# Altium schematic sheet FPGA_Memec_Virtex2P4_Dev_Board.SchDoc: Example for Virtex-II Pro Dev. Board
size B; Address1: L3, 12a Rodborough Rd; Address2: Frenchs Forest; Address3: NSW; Address4: Australia 2086; DocumentNumber: 1; Organization: Altium Limited; SheetNumber: 1; SheetTotal: 1
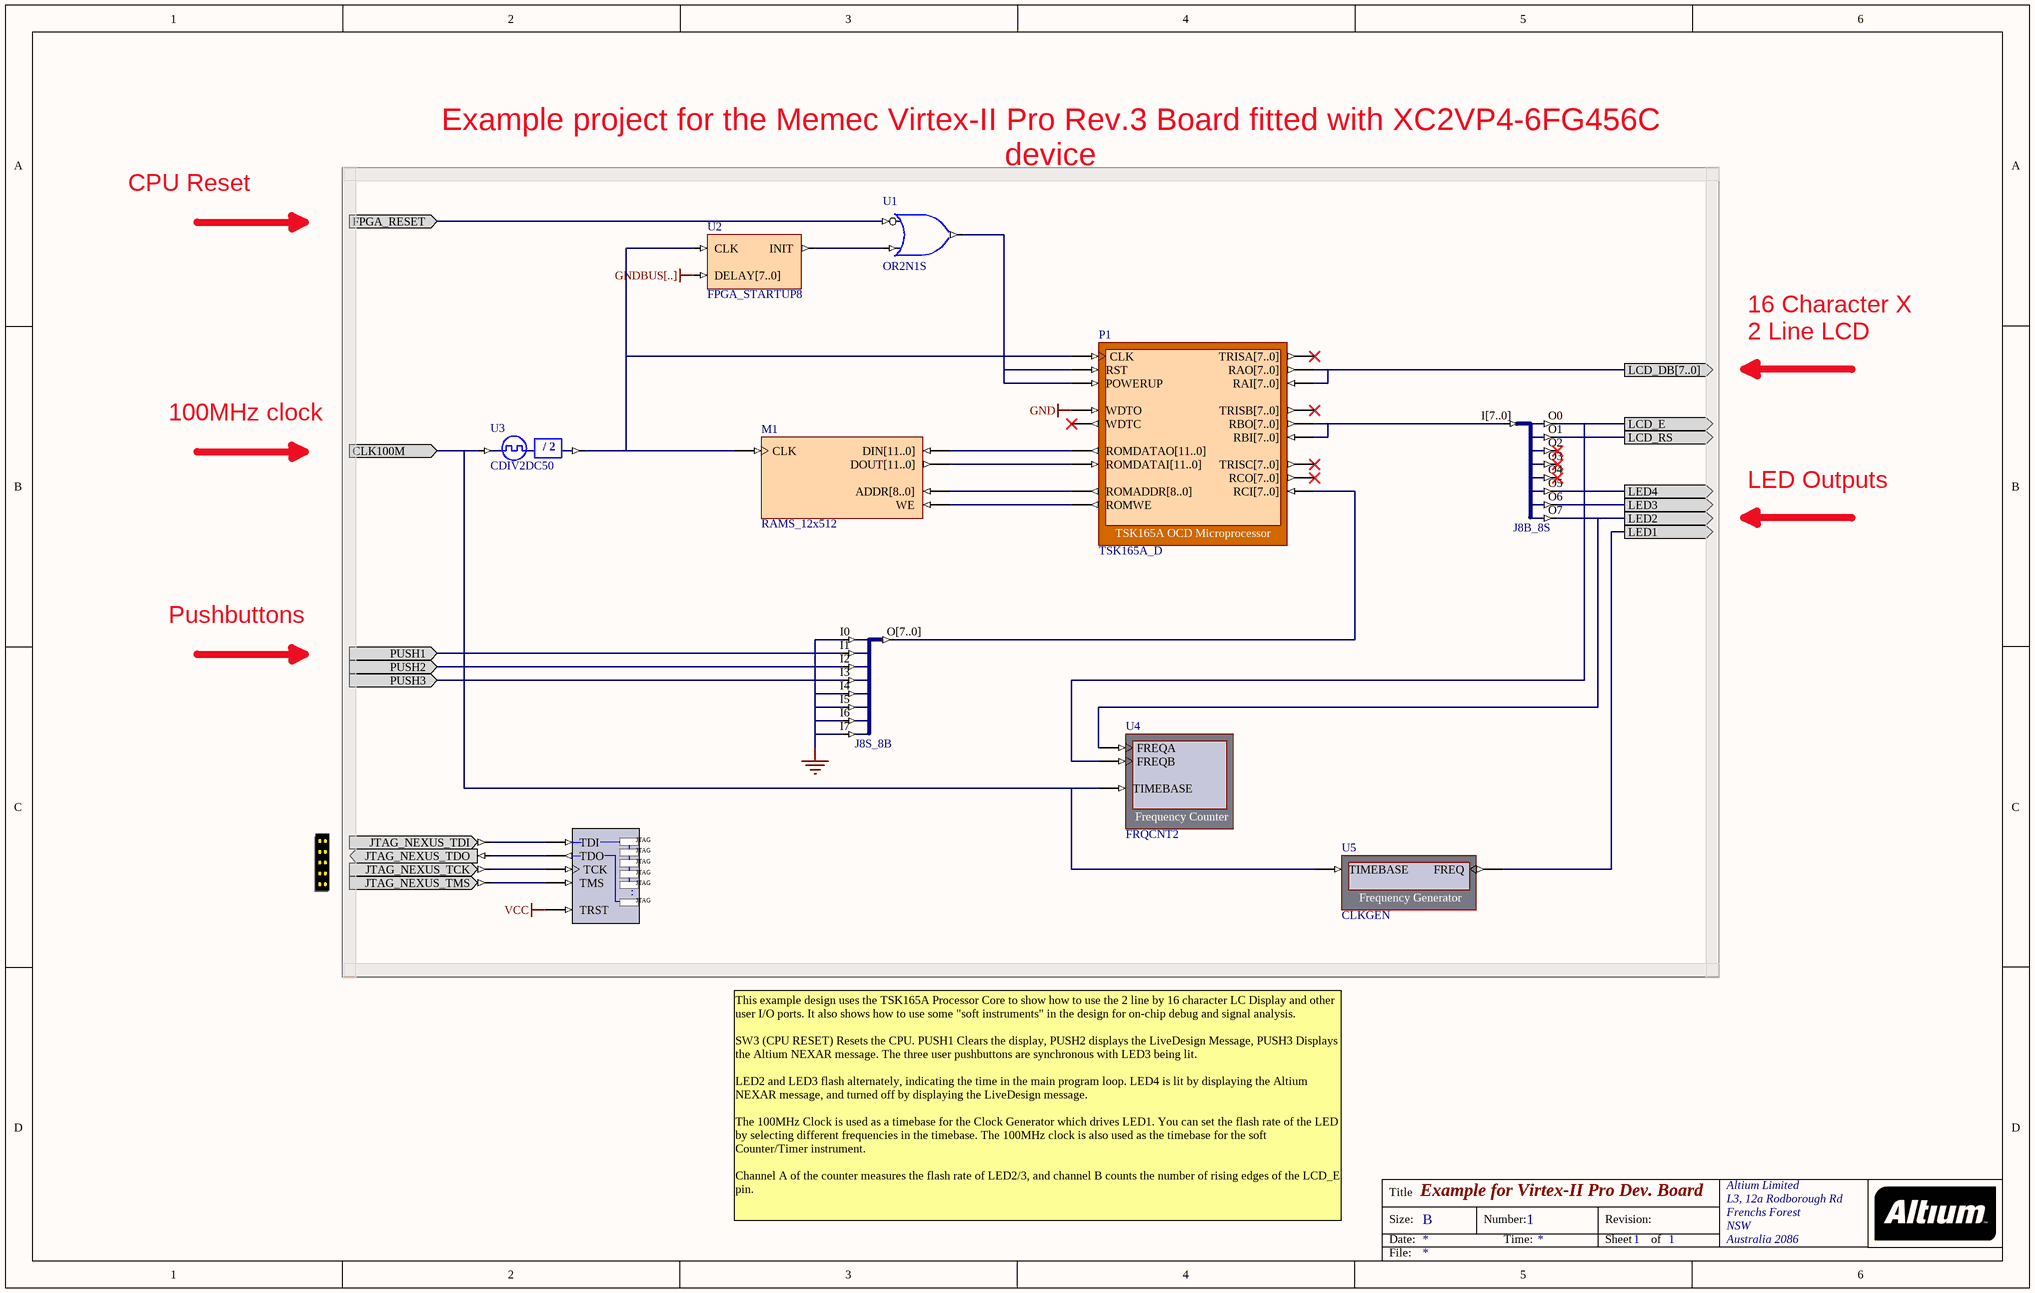
[diagram p0: FPGA_Memec_Virtex2P4_Dev_Board.SchDoc]

## Parts
?  NEXUS_JTAG_CONNECTOR  (value not drawn)
JB1  J8S_8B
JB2  J8B_8S
M1  RAMS_12x512
NEXUS_JTAG_PORT  NEXUS_JTAG_PORT  (value not drawn)
P1  TSK165A_D
U1  OR2N1S
U2  FPGA_STARTUP8
U3  CDIV2DC50
U4  FRQCNT2
U5  CLKGEN

## Ports
CLK100M (in), FPGA_RESET (in), LCD_DB[7..0] (out), LCD_E (out), LCD_RS (out), LED1 (out), LED2 (out), LED3 (out), LED4 (out), PUSH1 (in), PUSH2 (in), PUSH3 (in)

## Nets
GND: JB1.I0 JB1.I4 JB1.I5 JB1.I6 JB1.I7 P1.WDTO
GNDBUS[..]: U2.DELAY[7..0]
VCC: NEXUS_JTAG_PORT.TRST
CLK100M: U3.CLKIN U4.TIMEBASE U5.TIMEBASE ; port CLK100M
FPGA_RESET: U1.I0 ; port FPGA_RESET
LCD_DB[7..0]: P1.RAI[7..0] P1.RAO[7..0] ; port LCD_DB[7..0]
LCD_E: JB2.O0 U4.FREQB ; port LCD_E
LCD_RS: JB2.O1 ; port LCD_RS
LED1: U5.FREQ ; port LED1
LED2: JB2.O7 U4.FREQA ; port LED2
LED3: JB2.O6 ; port LED3
LED4: JB2.O5 ; port LED4
PUSH1: JB1.I1 ; port PUSH1
PUSH2: JB1.I2 ; port PUSH2
PUSH3: JB1.I3 ; port PUSH3
Net?_JTAG_NEXUS_TCK: ?.JTAG_NEXUS_TCK NEXUS_JTAG_PORT.TCK
Net?_JTAG_NEXUS_TDI: ?.JTAG_NEXUS_TDI NEXUS_JTAG_PORT.TDI
Net?_JTAG_NEXUS_TDO: ?.JTAG_NEXUS_TDO NEXUS_JTAG_PORT.TDO
Net?_JTAG_NEXUS_TMS: ?.JTAG_NEXUS_TMS NEXUS_JTAG_PORT.TMS
NetJB1_O[7..0]: JB1.O[7..0] P1.RCI[7..0]
NetJB2_I[7..0]: JB2.I[7..0] P1.RBI[7..0] P1.RBO[7..0]
NetM1_ADDR[8..0]: M1.ADDR[8..0] P1.ROMADDR[8..0]
NetM1_CLK: M1.CLK P1.CLK U2.CLK U3.CLKDV
NetM1_DIN[11..0]: M1.DIN[11..0] P1.ROMDATAO[11..0]
NetM1_DOUT[11..0]: M1.DOUT[11..0] P1.ROMDATAI[11..0]
NetM1_WE: M1.WE P1.ROMWE
NetP1_POWERUP: P1.POWERUP P1.RST U1.O
NetU1_I1: U1.I1 U2.INIT

Not connected (* = marked no-connect by the designer): JB2 O2* O3* O4*; P1 RCO[7..0]* TRISA[7..0]* TRISB[7..0]* TRISC[7..0]* WDTC*

## Notes on the sheet
- CPU Reset (SW3)
- (near U1) Example project for the Memec Virtex-II Pro Rev.3 Board fitted with XC2VP4-6FG456C device
- 16 Character X 2 Line LCD Display
- 100MHz clock
- LED Outputs
- Pushbuttons
- This example design uses the TSK165A Processor Core to show how to use the 2 line by 16 character LC Display and other user I/O ports. It also shows how to use some "soft instruments" in the design for on-chip debug and signal analysis.
  SW3 (CPU RESET) Resets the CPU. PUSH1 Clears the display, PUSH2 displays the LiveDesign Message, PUSH3 Displays the Altium NEXAR message. The three user pushbuttons are synchronous with LED3 being lit.
  LED2 and LED3 flash alternately, indicating the time in the main program loop. LED4 is lit by displaying the Altium NEXAR message, and turned off by displaying the LiveDesign message.
  The 100MHz Clock is used as a timebase for the Clock Generator which drives LED1. You can set the flash rate of the LED by selecting different frequencies in the timebase. The 100MHz clock is also used as the timebase for the soft Counter/Timer instrument.
  Channel A of the counter measures the flash rate of LED2/3, and channel B counts the number of rising edges of the LCD_E pin.
- Title
- Size:
- Date:
- B
- Number:
- Time:
- Revision:
- Sheet
- of
- File:
- (in symbol CDIV2DC50) / 2
- (in symbol NEXUS_JTAG_PORT) .

## Library data of the parts
? = NEXUS_JTAG_CONNECTOR: JTAG Port; PortComponent: True; Published: 19-Nov-2003; Publisher: Altium Limited
JB1 = J8S_8B: 8 Single pin inputs to single 8-Bit output bus; FunctionalClass: Bus Joiner; PortSize: 8; ArchiveName: GENERIC; VHDLIB_SIM: GENERIC_LIB; Published: 29-Jan-2004; Publisher: Altium Limited; LastRevisionNo: 1.00.00; HelpURL: CR0118 FPGA Generic Library Guide.pdf#page=305
JB2 = J8B_8S: 8-Bit input bus to 8 single pin outputs; FunctionalClass: Bus Joiner; PortSize: 8; ArchiveName: GENERIC; VHDLIB_SIM: GENERIC_LIB; Published: 29-Jan-2004; Publisher: Altium Limited; LastRevisionNo: 1.00.00; HelpURL: CR0118 FPGA Generic Library Guide.pdf#page=303
M1 = RAMS_12x512: Single Port RAM; Memory_Depth: 512; Memory_Type: RAM_SinglePortBlock; Memory_Width: 12; Memory_ClockEdge: Rising; Nexus_Core: Memory_Program; Memory_EnablePin: False; Published: 11/10/2004; Publisher: Altium Hobart Technology Center; Memory_ByteWrites: False
NEXUS_JTAG_PORT = NEXUS_JTAG_PORT: Soft Nexus-Chain Connector; NEXUS_JTAG_CONNECTOR: True; FunctionalClass: JTAG; Published: 29-Jan-2004; Publisher: Altium Limited; LastRevisionNo: 1.00.00; HelpURL: CR0118 FPGA Generic Library Guide.pdf#page=399
P1 = TSK165A_D: TSK165A OCD Microprocessor; NEXUS_CORE: Processor_OCDS; NEXUS_JTAG_DEVICE: True; NEXUS_JTAG_ORDER: 0; ChildModel1: TSK165A_D_RAM32X8; ChildCore1: M1; Published: 18/12/2003; Publisher: Altium Hobart Technology Centre; Core Revision: 1.00.00
U1 = OR2N1S: 2-Input OR Gate with Active Low A Input, Single Pin Version; XilinxEquivalent: OR2B1; FunctionalClass: Logic Primitive; PortSize: 2; ArchiveName: GENERIC; VHDLIB_SIM: GENERIC_LIB; Published: 29-Jan-2004; Publisher: Altium Limited; LastRevisionNo: 1.00.00; HelpURL: CR0118 FPGA Generic Library Guide.pdf#page=404; SubClass: OR; PortStyle: Single Pin Version
U2 = FPGA_STARTUP8: FPGA Startup With 8 Bit Delay; Published: 21/01/2004; Publisher: Altium Hobart Technology Centre; Core Revision: 1.00.00
U3 = CDIV2DC50: Clock Divider by 2 with 50% Duty Cycle Output; XilinxEquivalent: CLK_DIV2; DivisorRate: 2; DutyCycle: 50; ArchiveName: GENERIC; VHDLIB_SIM: GENERIC_LIB; Published: 29-Jan-2004; Publisher: Altium Limited; LastRevisionNo: 1.00.00; HelpURL: CR0118 FPGA Generic Library Guide.pdf#page=142; FunctionalClass: Clock Divider
U4 = FRQCNT2: Frequency Counter; NEXUS_CORE: Instrument; NEXUS_JTAG_DEVICE: True; NEXUS_JTAG_ORDER: 0; Published: 18/12/2003; Publisher: Altium Hobart Technology Centre; Core Revision: 1.00.00
U5 = CLKGEN: Frequency Generator; NEXUS_CORE: Instrument; NEXUS_JTAG_DEVICE: True; NEXUS_JTAG_ORDER: 0; Published: 18/12/2003; Publisher: Altium Hobart Technology Centre; Core Revision: 1.00.00